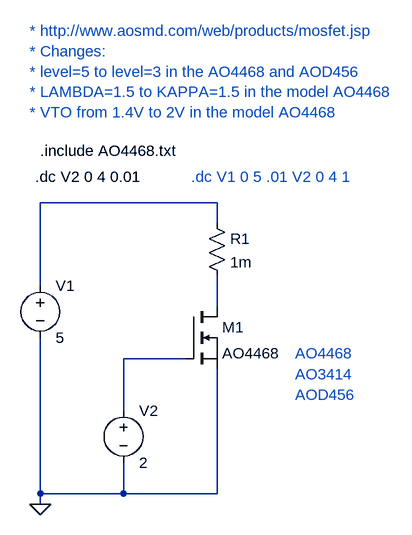
[diagram p0: schematic AO4468_test.asc]
AO4468_test.asc, the LTspice schematic file:
Version 4
SHEET 1 880 680
WIRE 256 -48 -16 -48
WIRE 256 -16 256 -48
WIRE -16 80 -16 -48
WIRE 256 112 256 64
WIRE 208 192 112 192
WIRE 112 272 112 192
WIRE -16 400 -16 160
WIRE 112 400 112 352
WIRE 112 400 -16 400
WIRE 256 400 256 208
WIRE 256 400 112 400
WIRE -16 416 -16 400
FLAG -16 416 0
SYMBOL nmos 208 112 R0
SYMATTR InstName M1
SYMATTR Value AO4468
SYMATTR Prefix X
SYMBOL voltage -16 64 R0
SYMATTR InstName V1
SYMATTR Value 5
SYMBOL voltage 112 256 R0
SYMATTR InstName V2
SYMATTR Value 2
SYMBOL res 240 -32 R0
SYMATTR InstName R1
SYMATTR Value 1m
TEXT -16 -128 Left 0 !.include AO4468.txt
TEXT -24 -88 Left 0 !.dc V2 0 4 0.01
TEXT 376 184 Left 0 ;AO4468
TEXT 376 216 Left 0 ;AO3414
TEXT 376 248 Left 0 ;AOD456
TEXT -32 -312 Left 0 ;* http://www.aosmd.com/web/products/mosfet.jsp\n* Changes: \n* level=5 to level=3 in the AO4468 and AOD456\n* LAMBDA=1.5 to KAPPA=1.5 in the model AO4468\n* VTO from 1.4V to 2V in the model AO4468
TEXT 216 -88 Left 0 ;.dc V1 0 5 .01 V2 0 4 1

The netlist it stands for:
* AO4468_test.asc
XM1 N002 N003 0 AO4468  ; pins D G S
V1 N001 0 5
V2 N003 0 2
R1 N001 N002 1m
.include AO4468.txt
.dc V2 0 4 0.01
* AO4468
* AO3414
* AOD456
* * http://www.aosmd.com/web/products/mosfet.jsp
* * Changes:
* * level=5 to level=3 in the AO4468 and AOD456
* * LAMBDA=1.5 to KAPPA=1.5 in the model AO4468
* * VTO from 1.4V to 2V in the model AO4468
* .dc V1 0 5 .01 V2 0 4 1
.backanno
.end